# EAGLE design C64Cart (EAGLE 7.2.0)
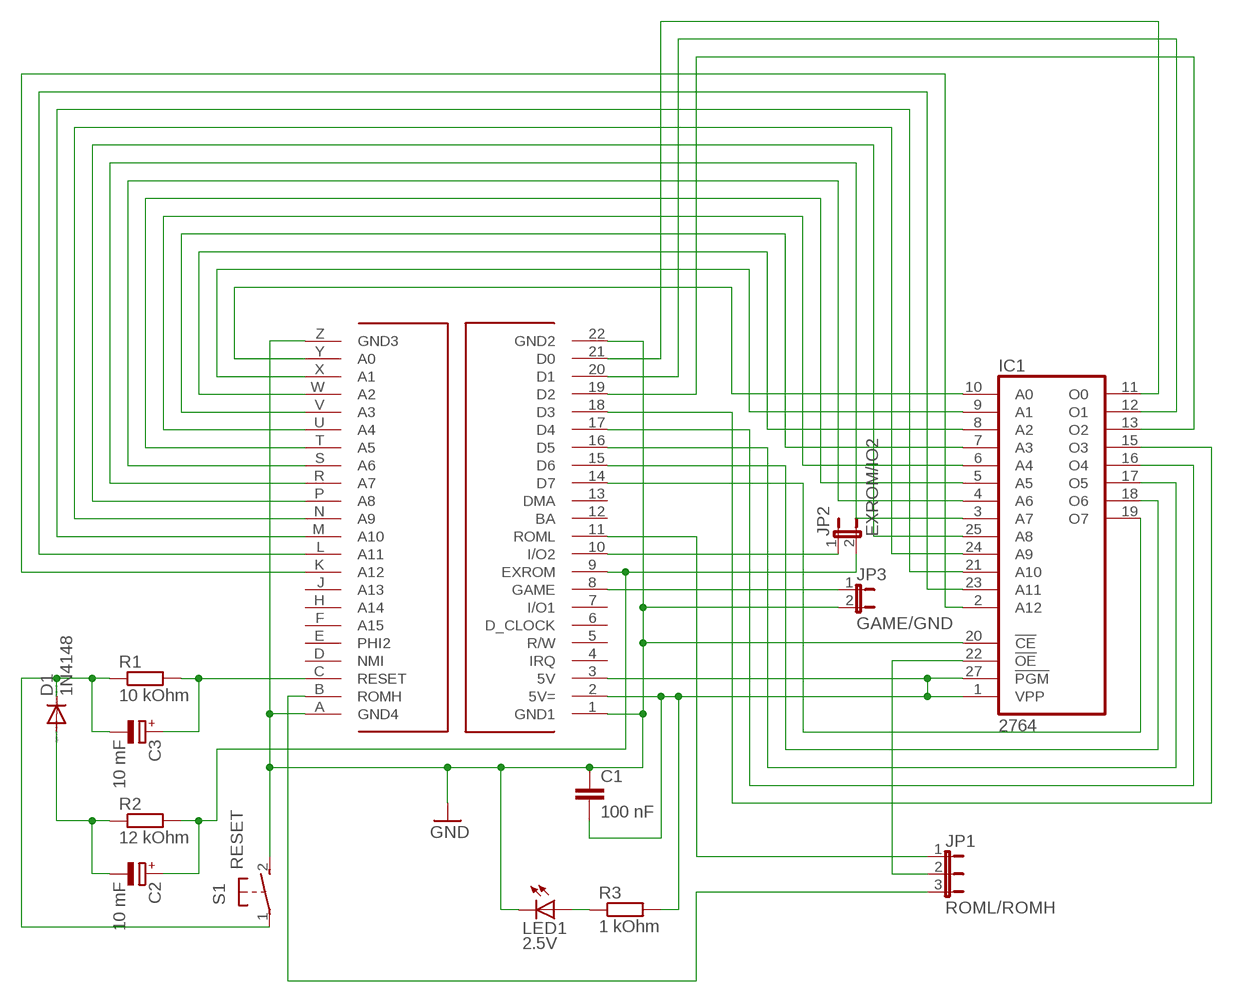
[diagram p0: schematic, sheet 1]

## Parts
C1  100 nF  C-EU050-025X075  [C050-025X075]
C2  10 mF  CPOL-EUE2-5  [E2-5]
C3  10 mF  CPOL-EUE2-5  [E2-5]
D1  1N4148  1N4148DO35-7  [DO35-7]
IC1  2764  [DIL28]
JP1  ROML/ROMH  JP2E  [JP2]
JP2  EXROM/IO2  JP1E  [JP1]
JP3  GAME/GND  JP1E  [JP1]
LED1  2.5V  LED3MM  [LED3MM]
R1  10 kOhm  R-EU_0204/7  [0204/7]
R2  12 kOhm  R-EU_0204/7  [0204/7]
R3  1 kOhm  R-EU_0204/7  [0204/7]
S1  RESET  31-XX  [B3F-31XX]
U$1  C64_CN  CARTRIDGE  [CARTRIDGE]

## Nets
C64CART: IC1.10(A0) U$1.Y(A0)
GND: C1.1 IC1.20(!CE) JP3.2 LED1.K(C) S1.2(S) U$1.1(GND1) U$1.22(GND2) U$1.A(GND4) U$1.Z(GND3)
N$1: JP3.1 U$1.8(GAME)
N$2: IC1.22(!OE) JP1.2
N$3: IC1.18(O6) U$1.15(D6)
N$4: IC1.9(A1) U$1.X(A1)
N$5: IC1.8(A2) U$1.W(A2)
N$6: IC1.7(A3) U$1.V(A3)
N$7: IC1.6(A4) U$1.U(A4)
N$8: IC1.5(A5) U$1.T(A5)
N$9: IC1.4(A6) U$1.S(A6)
N$10: IC1.3(A7) U$1.R(A7)
N$11: IC1.25(A8) U$1.P(A8)
N$12: IC1.24(A9) U$1.N(A9)
N$13: IC1.21(A10) U$1.M(A10)
N$14: IC1.23(A11) U$1.L(A11)
N$15: IC1.2(A12) U$1.K(A12)
N$16: IC1.11(O0) U$1.21(D0)
N$18: IC1.13(O2) U$1.19(D2)
N$19: IC1.17(O5) U$1.16(D5)
N$20: IC1.19(O7) U$1.14(D7)
N$21: IC1.15(O3) U$1.18(D3)
N$22: IC1.16(O4) U$1.17(D4)
N$25: C3.- D1.C R1.1 S1.1(P)
N$28: C2.+ JP2.2 R2.2 U$1.9(EXROM)
N$29: C3.+ R1.2 U$1.C(RESET)
N$30: IC1.12(O1) U$1.20(D1)
N$31: C2.- D1.A R2.1
N$32: LED1.A R3.1
N$33: JP2.1 U$1.10(I/O2)
N$34: JP1.1 U$1.11(ROML)
N$35: JP1.3 U$1.B(ROMH)
VCC: C1.2 IC1.1(VPP) IC1.27(!PGM) R3.2 U$1.2(5V=) U$1.3(5V)
Unconnected: U$1.4(IRQ) U$1.5(R/W) U$1.6(D_CLOCK) U$1.7(I/O1) U$1.12(BA) U$1.13(DMA) U$1.D(NMI) U$1.E(PHI2) U$1.F(A15) U$1.H(A14) U$1.J(A13)

## Power pins joined to a net without a drawn wire
GND: IC1.14(GND)
VCC: IC1.28(VCC)

## Library data of the parts
C1 = rcl:C-EU: CAPACITOR, European symbol
C2 C3 = rcl:CPOL-EU: POLARIZED CAPACITOR, European symbol
D1 = diode:1N4148: DIODE high speed (Philips)
IC1 = memory:2764: MEMORY
JP1 = jumper:JP2E: JUMPER
JP2 JP3 = jumper:JP1E: JUMPER
LED1 = led:LED: LED OSRAM: - CHIPLED LG R971, LG N971, LY N971, LG Q971, LY Q971, LO R971, LY R971 LH N974, LH R974 LS Q976, LO Q976, LY Q976 LO Q996 - Hyper CHIPLED LW Q18S LB Q993, LB Q99A, LB R99A - SideLED LS A670, LO A670, LY A670, LG A670, LP A670 LB A673, LV A673, LT A673, LW A673 LH A674 LY A675 LS A676, LA A676, LO A676, LY A676, LW A676 LS A679, LY A679, LG A679 - Hyper Micro SIDELED® LS Y876, LA Y876, LO Y876, LY Y876 LT Y87S - SmartLED LW L88C, LW L88S LB L89C, LB L89S, LG L890 LS L89K, LO L89K, LY L89K LS L896, LA L896, LO L896, LY L896 - TOPLED LS T670, LO T670, LY T670, LG T670, LP T670 LSG T670, LSP T670, LSY T670, LOP T670, LYG T670 LG T671, LOG T671, LSG T671 LB T673, LV T673, LT T673, LW T673 LH T674 LS T676, LA T676, LO T676, LY T676, LB T676, LH T676, LSB T676, LW T676 LB T67C, LV T67C, LT T67C, LS T67K, LO T67K, LY T67K, LW E67C LS E67B, LA E67B, LO E67B, LY E67B, LB E67C, LV E67C, LT E67C LW T67C LS T679, LY T679, LG T679 LS T770, LO T770, LY T770, LG T770, LP T770 LB T773, LV T773, LT T773, LW T773 LH T774 LS E675, LA E675, LY E675, LS T675 LS T776, LA T776, LO T776, LY T776, LB T776 LHGB T686 LT T68C, LB T68C - Hyper Mini TOPLED® LB M676 - Mini TOPLED Santana® LG M470 LS M47K, LO M47K, LY M47K Source: http://www.osram.convergy.de LUXEON: - LUMILED® LXK2-PW12-R00, LXK2-PW12-S00, LXK2-PW14-U00, LXK2-PW14-V00 LXK2-PM12-R00, LXK2-PM12-S00, LXK2-PM14-U00 LXK2-PE12-Q00, LXK2-PE12-R00, LXK2-PE12-S00, LXK2-PE14-T00, LXK2-PE14-U00 LXK2-PB12-K00, LXK2-PB12-L00, LXK2-PB12-M00, LXK2-PB14-N00, LXK2-PB14-P00, LXK2-PB14-Q00 LXK2-PR12-L00, LXK2-PR12-M00, LXK2-PR14-Q00, LXK2-PR14-R00 LXK2-PD12-Q00, LXK2-PD12-R00, LXK2-PD12-S00 LXK2-PH12-R00, LXK2-PH12-S00 LXK2-PL12-P00, LXK2-PL12-Q00, LXK2-PL12-R00 Source: www.luxeon.com KINGBRIGHT: KA-3528ASYC Source: www.kingbright.com
R1-R3 = resistor:R-EU_: RESISTOR, European symbol
S1 = switch-omron:31-XX: OMRON SWITCH; MPN: B3F-3100; OC_FARNELL: 959704; OC_NEWARK: 36M3582
U$1 = C64:CARTRIDGE

## Board
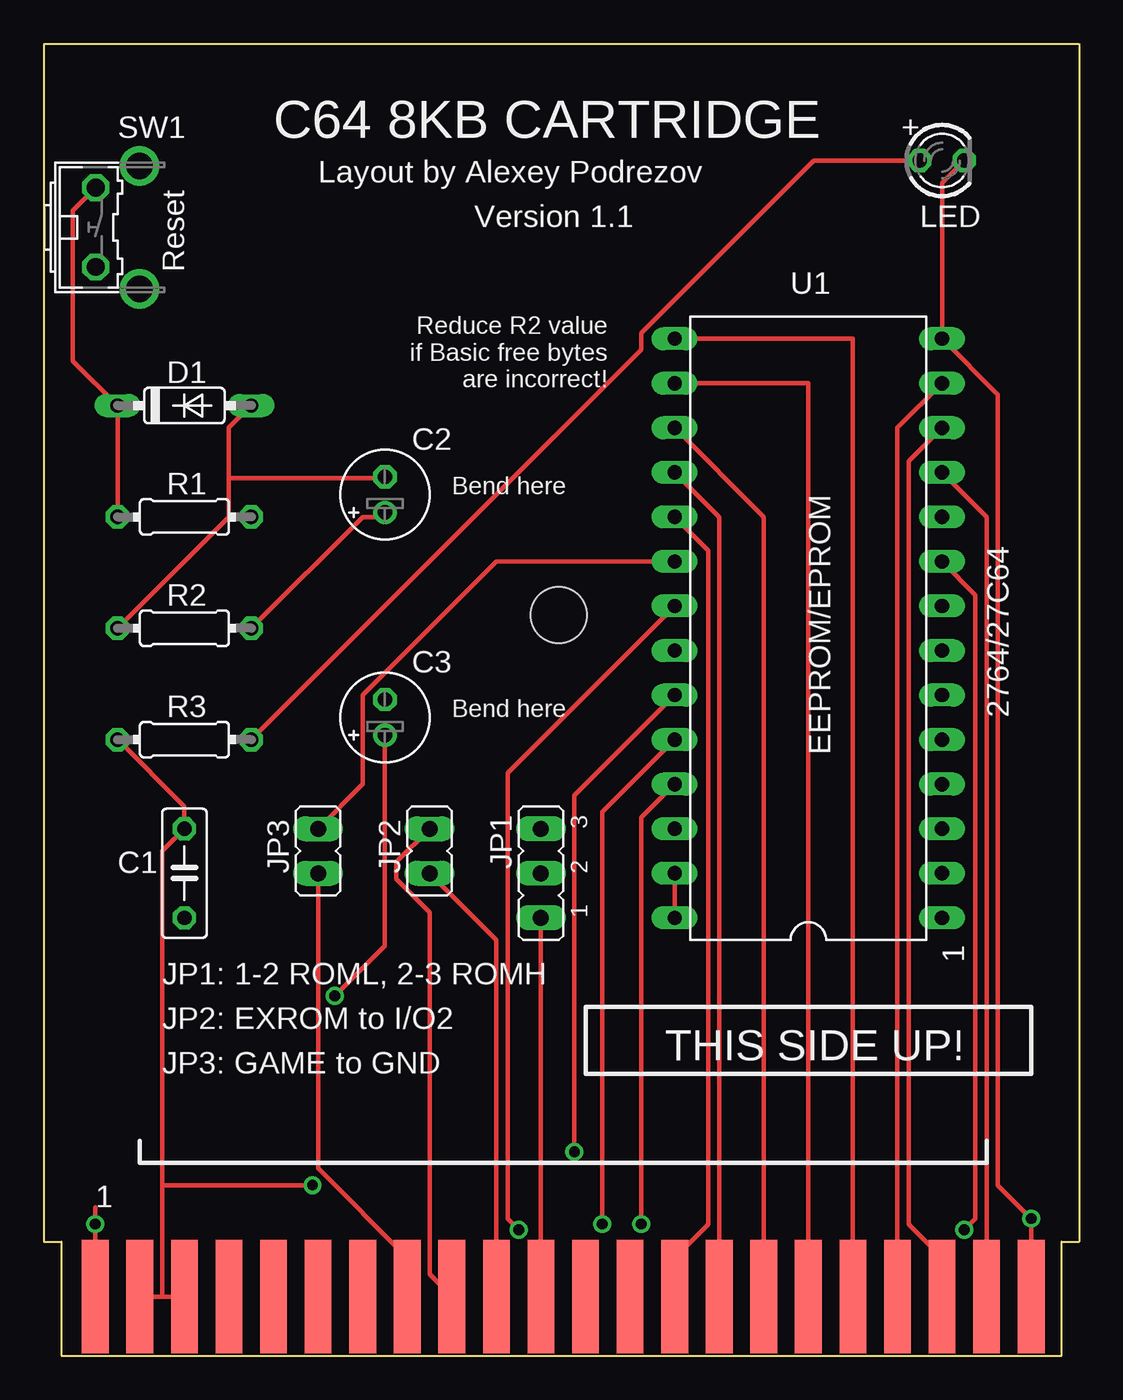
[diagram p1: board, top side]
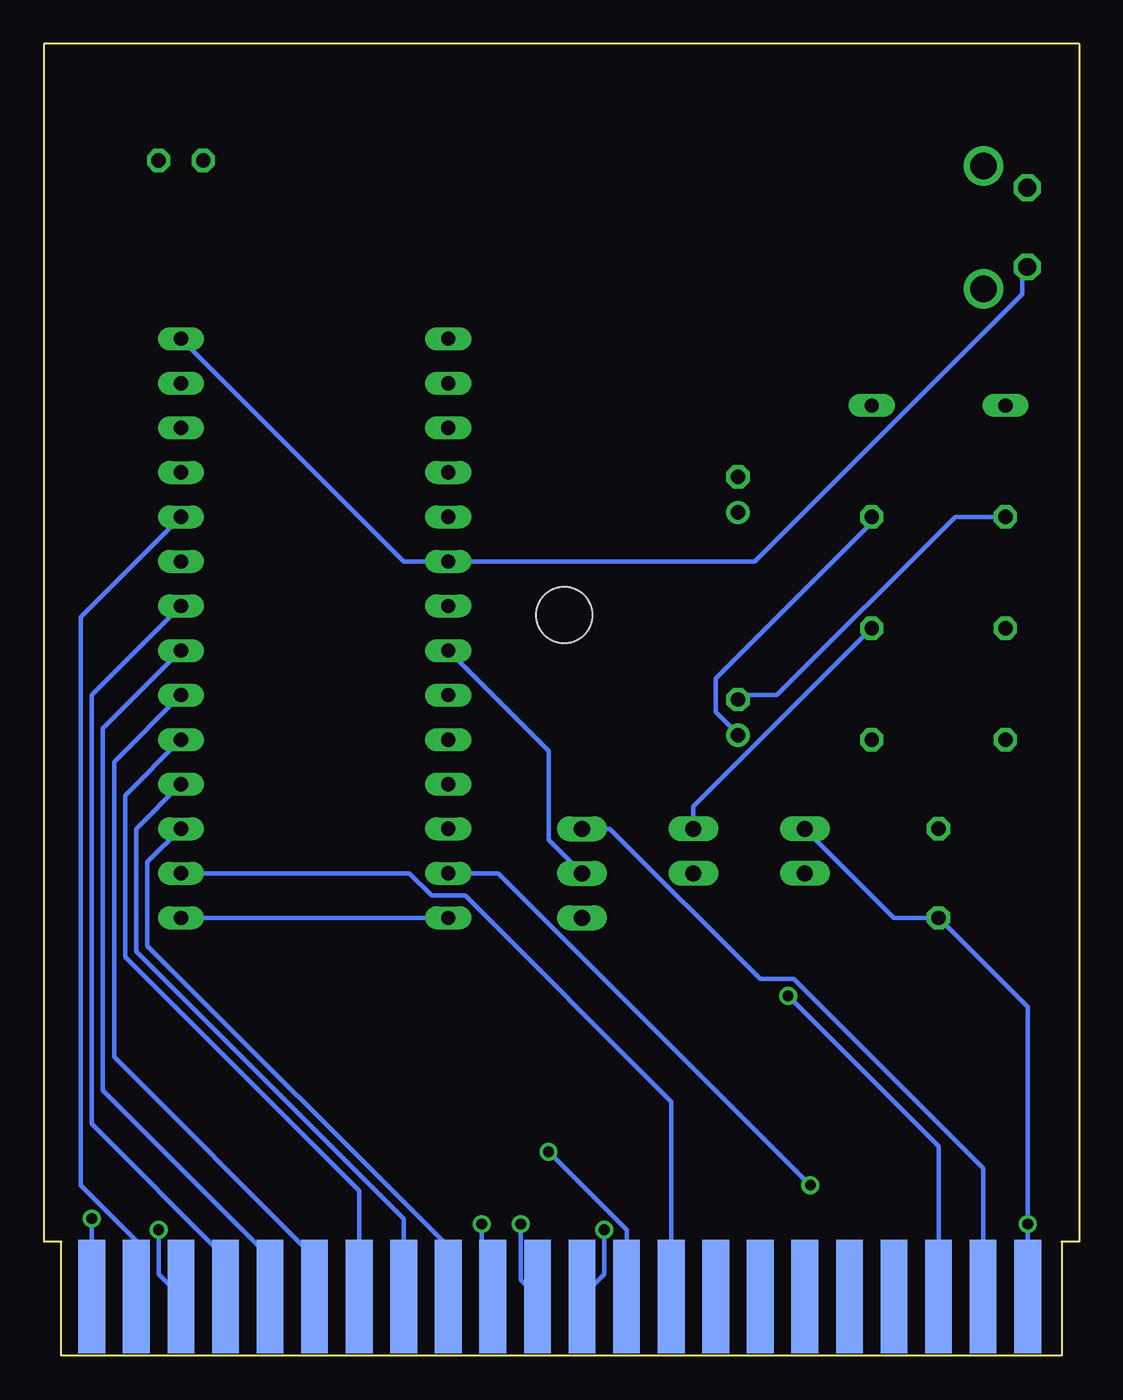
[diagram p2: board, bottom side, seen from below]

Size 59 x 74.79 mm. Coordinates in mm from the lower left corner, seen from the top.
Copper layers (1*16): Top 0.035mm / dielectric 1.5mm / Bottom 0.035mm
Design rules "default": minimum track width 10mil, minimum drill 24mil, track to track 8mil, track to pad 8mil, pad to pad 8mil, via to via 8mil, smd to smd 8mil, copper to edge 40mil, drill to drill 8mil, minimum pad ring 10mil, minimum via ring 8mil, stop-mask expansion 4mil, vias tented up to drill 0mil, thermal gap 10mil
Holes 3.2 mm at 29.35,42.23

### Footprints (pad centres in the part's own frame; a part is rotated, then mirrored left to right if it is on the bottom)
C050-025X075 = drill 0.813 octagon: 1 -2.54,0; 2 2.54,0
E2-5 = drill 0.813 pad 1.27: + -1.016,0 | drill 0.813 pad 1.27 octagon: - 1.016,0
DO35-7 = drill 0.813 long: A 3.81,0; C -3.81,0
DIL28 = drill 0.813 long: 1 -16.51,-7.62; 2 -13.97,-7.62; 3 -11.43,-7.62; 4 -8.89,-7.62; 5 -6.35,-7.62; 6 -3.81,-7.62; 7 -1.27,-7.62; 8 1.27,-7.62; 9 3.81,-7.62; 10 6.35,-7.62; 11 8.89,-7.62; 12 11.43,-7.62; 13 13.97,-7.62; 14 16.51,-7.62; 15 16.51,7.62; 16 13.97,7.62; 17 11.43,7.62; 18 8.89,7.62; 19 6.35,7.62; 20 3.81,7.62; 21 1.27,7.62; 22 -1.27,7.62; 23 -3.81,7.62; 24 -6.35,7.62; 25 -8.89,7.62; 26 -11.43,7.62; 27 -13.97,7.62; 28 -16.51,7.62
JP2 = drill 0.914 long: 1 -2.54,0; 2 0,0; 3 2.54,0
JP1 = drill 0.914 long: 1 0,-1.27; 2 0,1.27
LED3MM = drill 0.813 octagon: A -1.27,0; K 1.27,0
0204/7 = drill 0.813 octagon: 1 -3.81,0; 2 3.81,0
B3F-31XX = drill 1.016 octagon: 1 -2.261,-1.245; 2 2.261,-1.245 | drill 1.499 pad 2.159: 3 -3.505,1.245; 4 3.505,1.245
CARTRIDGE = smd 1.524 x 6.477: 1 -52.07,-24.13; 2 -49.53,-24.13; 3 -46.99,-24.13; 4 -44.45,-24.13; 5 -41.91,-24.13; 6 -39.37,-24.13; 7 -36.83,-24.13; 8 -34.29,-24.13; 9 -31.75,-24.13; 10 -29.21,-24.13; 11 -26.67,-24.13; 12 -24.13,-24.13; 13 -21.59,-24.13; 14 -19.05,-24.13; 15 -16.51,-24.13; 16 -13.97,-24.13; 17 -11.43,-24.13; 18 -8.89,-24.13; 19 -6.35,-24.13; 20 -3.81,-24.13; 21 -1.27,-24.13; 22 1.27,-24.13 | smd 1.524 x 6.477 bottom: A -52.07,-24.13; B -49.53,-24.13; C -46.99,-24.13; D -44.45,-24.13; E -41.91,-24.13; F -39.37,-24.13; H -36.83,-24.13; J -34.29,-24.13; K -31.75,-24.13; L -29.21,-24.13; M -26.67,-24.13; N -24.13,-24.13; P -21.59,-24.13; R -19.05,-24.13; S -16.51,-24.13; T -13.97,-24.13; U -11.43,-24.13; V -8.89,-24.13; W -6.35,-24.13; X -3.81,-24.13; Y -1.27,-24.13; Z 1.27,-24.13

### Placement (x,y rotation side)
C1  8.01,27.5 90 top
C2  19.44,49.09 90 top
C3  19.44,36.39 90 top
D1  8.01,54.17 0 top
IC1  43.57,41.47 90 top
JP1  28.33,27.5 90 top
JP2  21.98,28.77 0 top
JP3  15.63,28.77 0 top
LED1  51.19,68.14 0 top
R1  8.01,47.82 0 top
R2  8.01,41.47 0 top
R3  8.01,35.12 180 top
S1  4.2,64.33 270 top
U$1  55,27.5 0 top

### Tracks (layer width: path | path; a pad name or v marks a point on that pad's centre or on a via)
C64CART
  Bottom 0.254: IC1.10 56.91,42.11 56.91,9.72 53.73,6.54 U$1.Y
GND  (via drill 0.61)
  Top 0.254: 2.93,8.45 v2.93,7.5 U$1.A | U$1.22 v56.27,7.81 54.37,9.72 54.37,54.8 IC1.14 51.19,66.87 LED1.K | JP3.2 18.17,32.58 18.17,37.66 25.79,45.28 IC1.20
  Bottom 0.254: U$1.A v2.93,7.5 2.93,19.88 C1.1 10.55,24.96 JP3.2 | v56.27,7.81 U$1.22 | IC1.14 38.49,45.28 IC1.20 18.49,45.28 3.25,60.52 3.25,61.79 S1.2
N$1
  Top 0.254: JP3.1 15.63,10.67 20.71,5.59 U$1.8
N$2
  Bottom 0.254: IC1.22 30.23,34.48 30.23,29.4 JP1.2
N$3
  Top 0.254: IC1.18 38.49,47.82 U$1.15
N$4  (via drill 0.61)
  Top 0.254: IC1.9 53.09,43.38 53.09,7.81 v52.46,7.18
  Bottom 0.254: v52.46,7.18 52.46,4.64 U$1.X
N$5
  Bottom 0.254: IC1.8 56.27,37.66 56.27,13.21 48.65,5.59 U$1.W
N$6
  Bottom 0.254: IC1.7 55.63,35.75 55.63,15.12 46.11,5.59 U$1.V
N$7
  Bottom 0.254: IC1.6 55,33.85 55,17.02 43.57,5.59 U$1.U
N$8
  Bottom 0.254: IC1.5 54.37,31.94 54.37,22.74 41.03,9.4 U$1.T
N$9
  Bottom 0.254: IC1.4 53.73,30.04 53.73,23.05 38.49,7.81 U$1.S
N$10
  Bottom 0.254: IC1.3 53.09,28.13 53.09,23.37 35.95,6.23 U$1.R
N$11  (via drill 0.61)
  Top 0.254: IC1.25 34.05,30.67 v34.05,7.5
  Bottom 0.254: v34.05,7.5 34.05,4 U$1.P
N$12  (via drill 0.61)
  Top 0.254: IC1.24 31.82,30.99 v31.82,7.5
  Bottom 0.254: v31.82,7.5 31.82,4.32 U$1.N
N$13  (via drill 0.61)
  Top 0.254: IC1.21 26.43,33.22 26.43,7.81 v27.06,7.18
  Bottom 0.254: v27.06,7.18 27.06,4.64 U$1.M
N$14  (via drill 0.61)
  Top 0.254: IC1.23 30.23,31.94 v30.23,11.62
  Bottom 0.254: v30.23,11.62 25.79,7.18 U$1.L
N$15
  Bottom 0.254: IC1.2 38.17,27.5 36.9,26.23 35,26.23 23.25,14.48 U$1.K
N$16
  Top 0.254: IC1.11 53.73,47.82 U$1.21
N$18
  Top 0.254: IC1.13 48.65,52.9 U$1.19
N$19
  Top 0.254: IC1.17 41.03,47.82 U$1.16
N$20
  Top 0.254: IC1.19 37.86,45.91 37.86,7.5 35.95,5.59 U$1.14
N$21
  Top 0.254: IC1.15 46.11,57.98 U$1.18
N$22
  Top 0.254: IC1.16 43.57,55.44 U$1.17
N$25
  Top 0.254: R1.1 D1.C 1.66,56.71 1.66,65.28 2.93,66.55 S1.1
  Bottom 0.254: R1.1 7.06,47.82 17.22,37.66 19.44,37.66 C3.-
N$28
  Top 0.254: R2.2 18.17,47.82 19.44,47.82 C2.+ | U$1.9 21.98,4.64 21.98,25.28 20.07,27.18 20.07,28.13 JP2.2
  Bottom 0.254: JP2.2 21.98,31.31 R2.2
N$29  (via drill 0.61)
  Top 0.254: v16.58,20.51 19.44,23.37 C3.+
  Bottom 0.254: C3.+ 19.44,35.44 20.71,36.71 20.71,38.61 11.82,47.5 R1.2 | U$1.C 8.01,11.94 v16.58,20.51
N$30
  Top 0.254: IC1.12 49.29,51 49.29,7.5 51.19,5.59 U$1.20
N$31
  Top 0.254: R2.1 10.55,47.82 10.55,50.04 | 10.55,50.04 10.55,52.9 D1.A | 10.55,50.04 19.44,50.04 C2.-
N$32
  Top 0.254: R3.1 34.05,57.34 34.05,58.3 43.89,68.14 LED1.A
N$33
  Top 0.254: JP2.1 25.79,23.69 U$1.10
N$34
  Top 0.254: U$1.11 JP1.1
N$35
  Bottom 0.254: JP1.3 26.74,30.04 18.17,21.47 16.27,21.47 5.47,10.67 U$1.B
VCC  (via drill 0.61)
  Top 0.254: IC1.27 IC1.28 | U$1.2 6.74,3.37 | 6.74,3.37 U$1.3 | R3.2 8.01,31.31 C1.2 6.74,28.77 6.74,9.72 | 6.74,3.37 6.74,9.72 | 6.74,9.72 v15.31,9.72
  Bottom 0.254: IC1.28 IC1.1 | IC1.27 33.09,27.5 v15.31,9.72

### Text on the board
tNames: + | SW1 | C64 8KB CARTRIDGE | Layout by Alexey Podrezov | Version 1.1 | LED | Reset | U1 | Reduce R2 value / if Basic free bytes / are incorrect! | D1 | C2 | R1 | Bend here | EEPROM/EPROM | R2 | C3 | R3 | Bend here | 2764/27C64 | C1 | 1 | JP1: 1-2 ROML, 2-3 ROMH | JP2: EXROM to I/O2 | THIS SIDE UP! | JP3: GAME to GND | 1